# Altium schematic sheet LogicCircuits_main.SchDoc
size A4
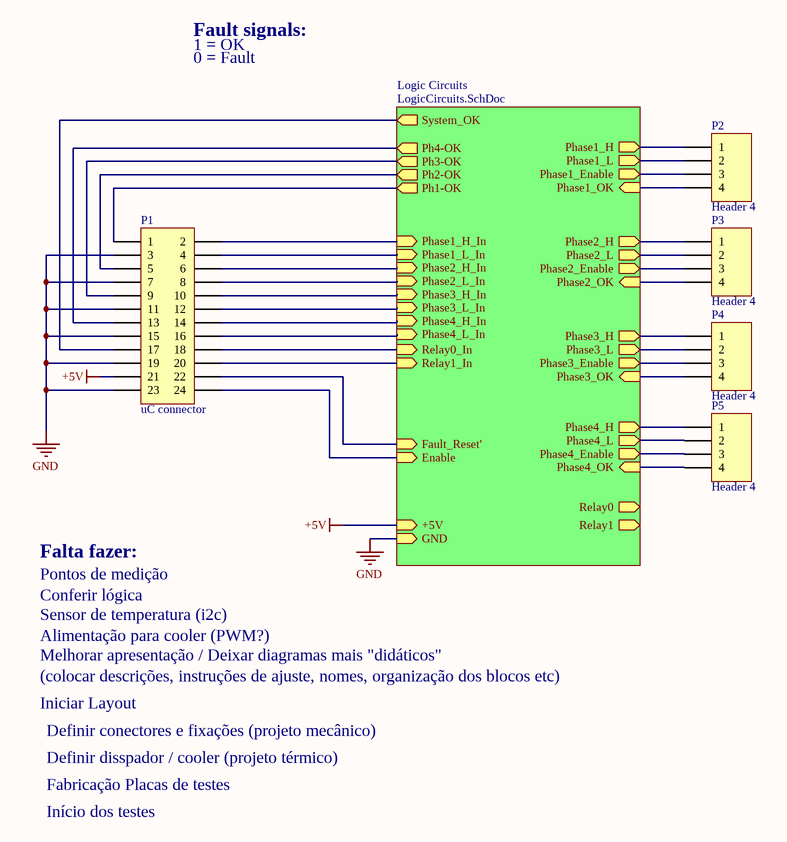
[diagram p0: LogicCircuits_main.SchDoc]

## Parts
P1  uC connector  [HDR2X12]
P2  Header 4  [HDR1X4]
P3  Header 4  [HDR1X4]
P4  Header 4  [HDR1X4]
P5  Header 4  [HDR1X4]

## Sub-sheets
Logic Circuits = LogicCircuits.SchDoc: Phase1_OK (in), Phase2_OK (in), Phase3_OK (in), Phase4_OK (in), +5V (in), GND (in), Phase1_H (out), Phase1_L (out), Phase2_H (out), Phase2_L (out), Phase3_H (out), Phase3_L (out), Phase4_H (out), Phase4_L (out), Phase1_Enable (out), Phase2_Enable (out), Phase3_Enable (out), Phase4_Enable (out), Relay1_In (in), Relay1 (out), System_OK (out), Relay0_In (in), Relay0 (out), Enable (in), Fault_Reset' (in), Phase1_H_In (in), Phase1_L_In (in), Phase2_H_In (in), Phase2_L_In (in), Phase3_H_In (in), Phase3_L_In (in), Phase4_H_In (in), Phase4_L_In (in), Ph1-OK (out), Ph2-OK (out), Ph3-OK (out), Ph4-OK (out)

## Nets
+5V: P1.21 ; sheet Logic Circuits/+5V
GND: P1.3 P1.7 P1.11 P1.15 P1.19 P1.23 ; sheet Logic Circuits/GND
NetP1_1: P1.1 ; sheet Logic Circuits/Ph1-OK
NetP1_2: P1.2 ; sheet Logic Circuits/Phase1_H_In
NetP1_4: P1.4 ; sheet Logic Circuits/Phase1_L_In
NetP1_5: P1.5 ; sheet Logic Circuits/Ph2-OK
NetP1_6: P1.6 ; sheet Logic Circuits/Phase2_H_In
NetP1_8: P1.8 ; sheet Logic Circuits/Phase2_L_In
NetP1_9: P1.9 ; sheet Logic Circuits/Ph3-OK
NetP1_10: P1.10 ; sheet Logic Circuits/Phase3_H_In
NetP1_12: P1.12 ; sheet Logic Circuits/Phase3_L_In
NetP1_13: P1.13 ; sheet Logic Circuits/Ph4-OK
NetP1_14: P1.14 ; sheet Logic Circuits/Phase4_H_In
NetP1_16: P1.16 ; sheet Logic Circuits/Phase4_L_In
NetP1_17: P1.17 ; sheet Logic Circuits/System_OK
NetP1_18: P1.18 ; sheet Logic Circuits/Relay0_In
NetP1_20: P1.20 ; sheet Logic Circuits/Relay1_In
NetP1_22: P1.22 ; sheet Logic Circuits/Fault_Reset'
NetP1_24: P1.24 ; sheet Logic Circuits/Enable
NetP2_1: P2.1 ; sheet Logic Circuits/Phase1_H
NetP2_2: P2.2 ; sheet Logic Circuits/Phase1_L
NetP2_3: P2.3 ; sheet Logic Circuits/Phase1_Enable
NetP2_4: P2.4 ; sheet Logic Circuits/Phase1_OK
NetP3_1: P3.1 ; sheet Logic Circuits/Phase2_H
NetP3_2: P3.2 ; sheet Logic Circuits/Phase2_L
NetP3_3: P3.3 ; sheet Logic Circuits/Phase2_Enable
NetP3_4: P3.4 ; sheet Logic Circuits/Phase2_OK
NetP4_1: P4.1 ; sheet Logic Circuits/Phase3_H
NetP4_2: P4.2 ; sheet Logic Circuits/Phase3_L
NetP4_3: P4.3 ; sheet Logic Circuits/Phase3_Enable
NetP4_4: P4.4 ; sheet Logic Circuits/Phase3_OK
NetP5_1: P5.1 ; sheet Logic Circuits/Phase4_H
NetP5_2: P5.2 ; sheet Logic Circuits/Phase4_L
NetP5_3: P5.3 ; sheet Logic Circuits/Phase4_Enable
NetP5_4: P5.4 ; sheet Logic Circuits/Phase4_OK

## Notes on the sheet
- Fault signals:
- 1 = OK
- 0 = Fault
- Falta fazer:
- Pontos de medição
- Conferir lógica
- Sensor de temperatura (i2c)
- Alimentação para cooler (PWM?)
- Melhorar apresentação / Deixar diagramas mais "didáticos"
- (colocar descrições, instruções de ajuste, nomes, organização dos blocos etc)
- Iniciar Layout
- Definir disspador / cooler (projeto térmico)
- Definir conectores e fixações (projeto mecânico)
- Fabricação Placas de testes
- Início dos testes

## Library data of the parts
P1 = Header 12X2: Header, 12-Pin, Dual row; LatestRevisionDate: 17-Jul-2002; LatestRevisionNote: Re-released for DXP Platform.; Publisher: Altium Limited
P2-P5 = Header 4: Header, 4-Pin; LatestRevisionDate: 17-Jul-2002; LatestRevisionNote: Re-released for DXP Platform.; Publisher: Altium Limited